# Altium schematic sheet motor1.SchDoc
size A4; SheetNumber: 3; SheetTotal: 4
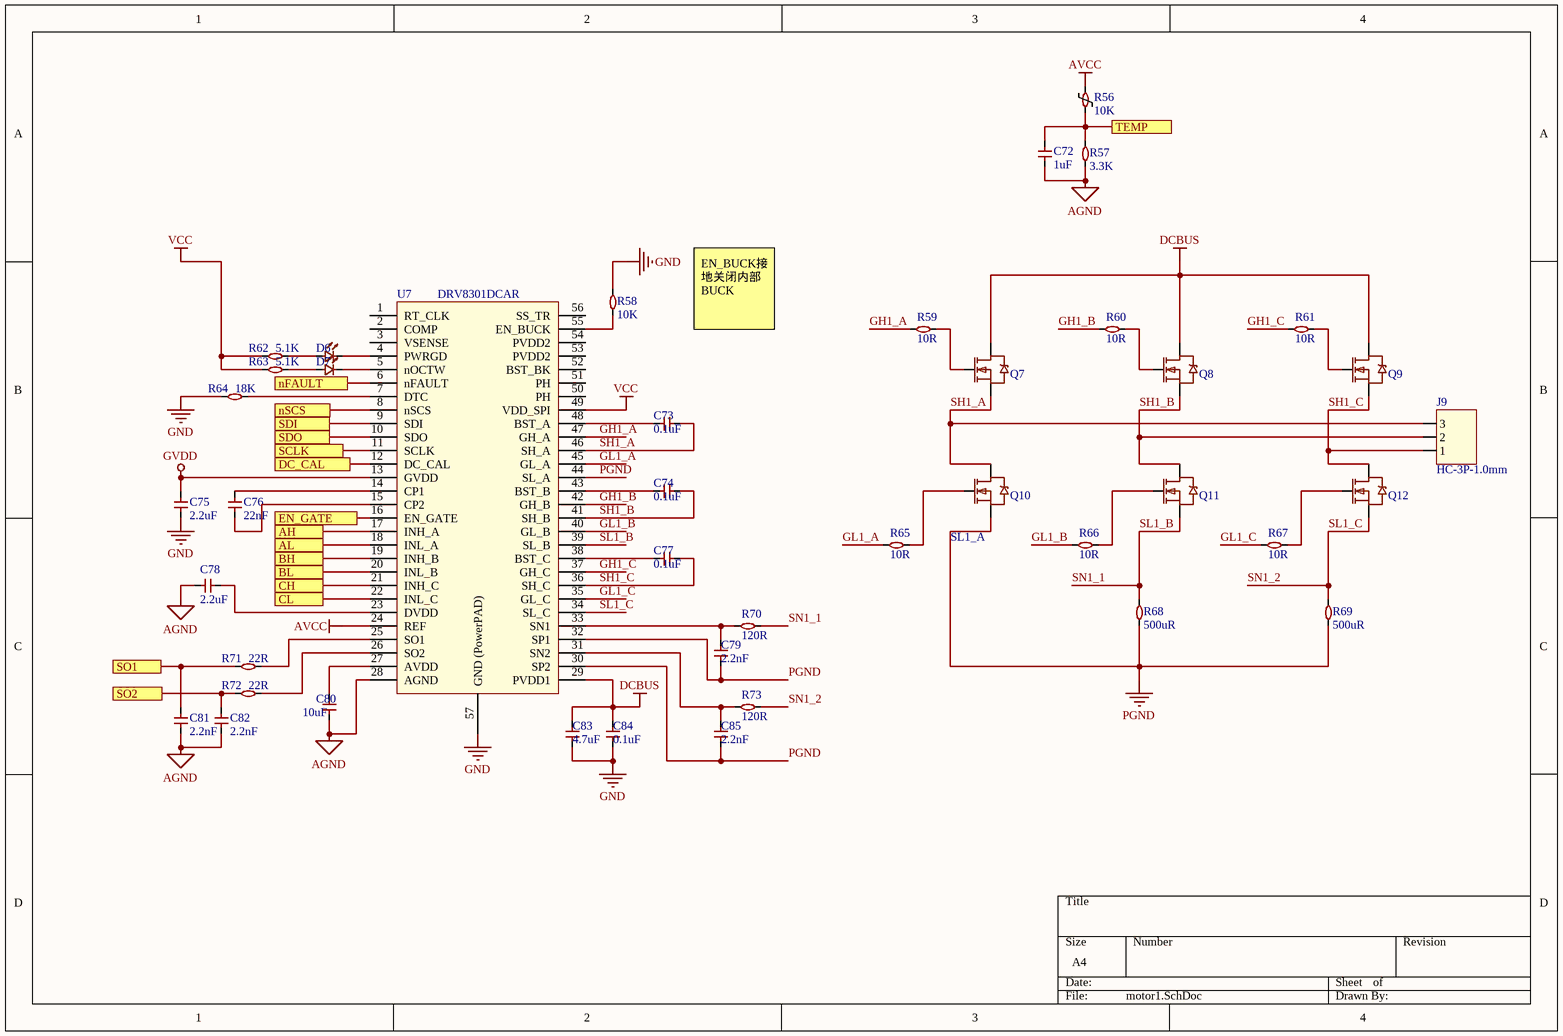
[diagram p0: motor1.SchDoc]

## Parts
C72  1uF  [C0402]
C73  0.1uF  [C0402]
C74  0.1uF  [C0402]
C75  2.2uF  [C0402]
C76  22nF  [C0402]
C77  0.1uF  [C0402]
C78  2.2uF  [C0402]
C79  2.2nF  [C0402]
C80  10uF  [C0402]
C81  2.2nF  [C0402]
C82  2.2nF  [C0402]
C83  4.7uF  [C0402]
C84  0.1uF  [C0402]
C85  2.2nF  [C0402]
D6  LED  [LED-0402]  (value not drawn)
D7  LED  [LED-0402]  (value not drawn)
J9  HC-3P-1.0mm  [AMASS-MR30-M]
Q7  AP68N06G  [TDSON-8_L5.0-W6.0-3PIN]  (value not drawn)
Q8  AP68N06G  [TDSON-8_L5.0-W6.0-3PIN]  (value not drawn)
Q9  AP68N06G  [TDSON-8_L5.0-W6.0-3PIN]  (value not drawn)
Q10  AP68N06G  [TDSON-8_L5.0-W6.0-3PIN]  (value not drawn)
Q11  AP68N06G  [TDSON-8_L5.0-W6.0-3PIN]  (value not drawn)
Q12  AP68N06G  [TDSON-8_L5.0-W6.0-3PIN]  (value not drawn)
R56  10K  [R0402]
R57  3.3K  [R0402]
R58  10K  [R0402]
R59  10R  [R0402]
R60  10R  [R0402]
R61  10R  [R0402]
R62  5.1K  [R0402]
R63  5.1K  [R0402]
R64  18K  [R0402]
R65  10R  [R0402]
R66  10R  [R0402]
R67  10R  [R0402]
R68  500uR  [R2512]
R69  500uR  [R2512]
R70  120R  [R0402]
R71  22R  [R0402]
R72  22R  [R0402]
R73  120R  [R0402]
U7  DRV8301DCAR  [HTSSOP-56_L14.0-W6.0-P0.50]

## Ports
AH (see main[7B]), AL (see main[7B]), BH (see main[7B]), BL (see main[7B]), CH (see main[7B]), CL (see main[7B]), DC_CAL (see main[7B]), EN_GATE (see main[7B], motor0[1C]), nFAULT (see main[8B], motor0[1B]), nSCS (see main[7B]), SCLK (see main[7B], motor0[1B]), SDI (see main[7B], motor0[1B]), SDO (see main[7B], motor0[1B]), SO1 (see main[8B]), SO2 (see main[8B]), TEMP (see main[8B])

## Nets
AGND: C72.2 C78.1 C80.2 C81.2 C82.2 R57.1 U7.28(AGND)
AVCC: R56.2 U7.24(REF)
DCBUS: C83.1 C84.1 Q7.3(D) Q8.3(D) Q9.3(D) U7.29(PVDD1)
GND: C75.1 C83.2 C84.2 R58.2 R64.1 U7.57(GND_(PowerPAD))
GVDD: C75.2 U7.13(GVDD)
PGND: C79.2 C85.2 Q10.2(S) R68.2 R69.2 U7.30(SP2) U7.32(SP1) U7.44(SL_A)
VCC: R62.1 R63.1 U7.49(VDD_SPI)
AH: U7.17(INH_A) ; port AH
AL: U7.18(INL_A) ; port AL
BH: U7.19(INH_B) ; port BH
BL: U7.20(INL_B) ; port BL
CH: U7.21(INH_C) ; port CH
CL: U7.22(INL_C) ; port CL
DC_CAL: U7.12(DC_CAL) ; port DC_CAL
EN_GATE: U7.16(EN_GATE) ; port EN_GATE
GH1_A: R59.2 U7.47(GH_A)
GH1_B: R60.2 U7.42(GH_B)
GH1_C: R61.2 U7.37(GH_C)
GL1_A: R65.2 U7.45(GL_A)
GL1_B: R66.2 U7.40(GL_B)
GL1_C: R67.2 U7.35(GL_C)
nFAULT: U7.6(nFAULT) ; port nFAULT
nSCS: U7.8(nSCS) ; port nSCS
SCLK: U7.11(SCLK) ; port SCLK
SDI: U7.9(SDI) ; port SDI
SDO: U7.10(SDO) ; port SDO
SH1_A: C73.2 J9.3 Q7.2(S) Q10.3(D) U7.46(SH_A)
SH1_B: C74.2 J9.2 Q8.2(S) Q11.3(D) U7.41(SH_B)
SH1_C: C77.2 J9.1 Q9.2(S) Q12.3(D) U7.36(SH_C)
SL1_B: Q11.2(S) R68.1 R70.2 U7.39(SL_B)  [also labelled SN1_1]
SL1_C: Q12.2(S) R69.1 R73.2 U7.34(SL_C)  [also labelled SN1_2]
SO1: C81.1 R71.1 ; port SO1
SO2: C82.1 R72.1 ; port SO2
TEMP: C72.1 R56.1 R57.2 ; port TEMP
NetC73_1: C73.1 U7.48(BST_A)
NetC74_1: C74.1 U7.43(BST_B)
NetC76_1: C76.1 U7.15(CP2)
NetC76_2: C76.2 U7.14(CP1)
NetC77_1: C77.1 U7.38(BST_C)
NetC78_2: C78.2 U7.23(DVDD)
NetC79_1: C79.1 R70.1 U7.33(SN1)
NetC80_1: C80.1 U7.27(AVDD)
NetC85_1: C85.1 R73.1 U7.31(SN2)
NetD6_1: D6.1 U7.4(PWRGD)
NetD6_2: D6.2 R62.2
NetD7_1: D7.1 U7.5(nOCTW)
NetD7_2: D7.2 R63.2
NetQ7_1: Q7.1(G) R59.1
NetQ8_1: Q8.1(G) R60.1
NetQ9_1: Q9.1(G) R61.1
NetQ10_1: Q10.1(G) R65.1
NetQ11_1: Q11.1(G) R66.1
NetQ12_1: Q12.1(G) R67.1
NetR58_1: R58.1 U7.55(EN_BUCK)
NetR64_2: R64.2 U7.7(DTC)
NetR71_2: R71.2 U7.25(SO1)
NetR72_2: R72.2 U7.26(SO2)

Not connected (* = marked no-connect by the designer): U7 1(RT_CLK) 2(COMP) 3(VSENSE) 50(PH) 51(PH) 52(BST_BK) 53(PVDD2) 54(PVDD2) 56(SS_TR)

## Notes on the sheet
- EN_BUCK接地关闭内部BUCK
- (near Q10) SL1_A

## Library data of the parts
C72-C85 = CAP: 贴片电容; Manufacturer: SAMSUNG(三星); Manufacturer Part: CL05A105KP5NNND; Add into BOM: yes; Tolerance: ±10%; Voltage Rated: 10V; Temperature Coefficient: X5R; Symbol: CAP-0402; Device: cap-0402; LCSC Part Name: 1uF ±10% 10V; Supplier Part: C307414; Supplier Footprint: 0402; JLCPCB Part Class: Extended Part; Datasheet: https://atta.szlcsc.com/upload/public/pdf/source/20181009/C307414_0A02B57115E94FED95F0CB1E32115BFC.pdf; Supplier: LCSC; Convert to PCB: yes
D6 D7 = LED: 贴片发光二极管; Manufacturer: SAMSUNG(三星); Manufacturer Part: CL05A105KP5NNND; Add into BOM: yes; Tolerance: ±10%; Voltage Rated: 10V; Temperature Coefficient: X5R; Symbol: CAP-0402; Device: cap-0402; LCSC Part Name: 1uF ±10% 10V; Supplier Part: C307414; Supplier Footprint: 0402; JLCPCB Part Class: Extended Part; Datasheet: https://atta.szlcsc.com/upload/public/pdf/source/20181009/C307414_0A02B57115E94FED95F0CB1E32115BFC.pdf; Supplier: LCSC; Convert to PCB: yes
J9 = HC-3P-1.0mm: 线对板连接器
Q7-Q12 = NMOS: N沟道功率mos管; Manufacturer: BORN(伯恩半导体); Name: AO3401A; Symbol: AO3401A_C306862; Add into BOM: yes; Type: P沟道; Drain Source Voltage (Vdss): 30V; Continuous Drain Current (Id): 4.2A; Power Dissipation (Pd): 1.4W; Drain Source On Resistance (RDS(on)@Vgs,Id): 50mΩ@10V,4.1A; Gate Threshold Voltage (Vgs(th)@Id): 2V@250uA; Device: AO3401A_C306862; LCSC Part Name: P沟道 30V 4.2A; Supplier Part: C306862; Manufacturer Part: AO3401A; Supplier Footprint: SOT-23; JLCPCB Part Class: 扩展库; Datasheet: https://atta.szlcsc.com/upload/public/pdf/source/20190514/C306862_F7EF2FFF49BA48EA0D342955B5285B33.pdf; Supplier: LCSC; Convert to PCB: yes
R56 = NTC: 热敏电阻; Manufacturer: UNI-ROYAL(厚声); Manufacturer Part: 0402WGF1001TCE; Add into BOM: yes; Tolerance: ±1%; Power(Watts): 1/16W; Temperature Coefficient: ±100ppm/; Overload Voltage (Max): 50V; Symbol: RES-0402; Device: res-0402; LCSC Part Name: 1k ±1%; Supplier Part: C11702; Supplier Footprint: 0402; Datasheet: https://atta.szlcsc.com/upload/public/pdf/source/20200306/C422600_1E6D84923E4A46A82E41ADD87F860B5C.pdf; Supplier: LCSC; Convert to PCB: yes; Type: 厚膜电阻; Operating Temperature Range: -55~+155; JLCPCB Part Class: 基础库
R57-R73 = RES: 贴片电阻; Manufacturer: UNI-ROYAL(厚声); Manufacturer Part: 0402WGF1001TCE; Add into BOM: yes; Tolerance: ±1%; Power(Watts): 1/16W; Temperature Coefficient: ±100ppm/; Overload Voltage (Max): 50V; Symbol: RES-0402; Device: res-0402; LCSC Part Name: 1k ±1%; Supplier Part: C11702; Supplier Footprint: 0402; Datasheet: https://atta.szlcsc.com/upload/public/pdf/source/20200306/C422600_1E6D84923E4A46A82E41ADD87F860B5C.pdf; Supplier: LCSC; Convert to PCB: yes; Type: 厚膜电阻; Operating Temperature Range: -55~+155; JLCPCB Part Class: 基础库
U7 = DRV8301DCAR: 三相电机/栅极驱动IC